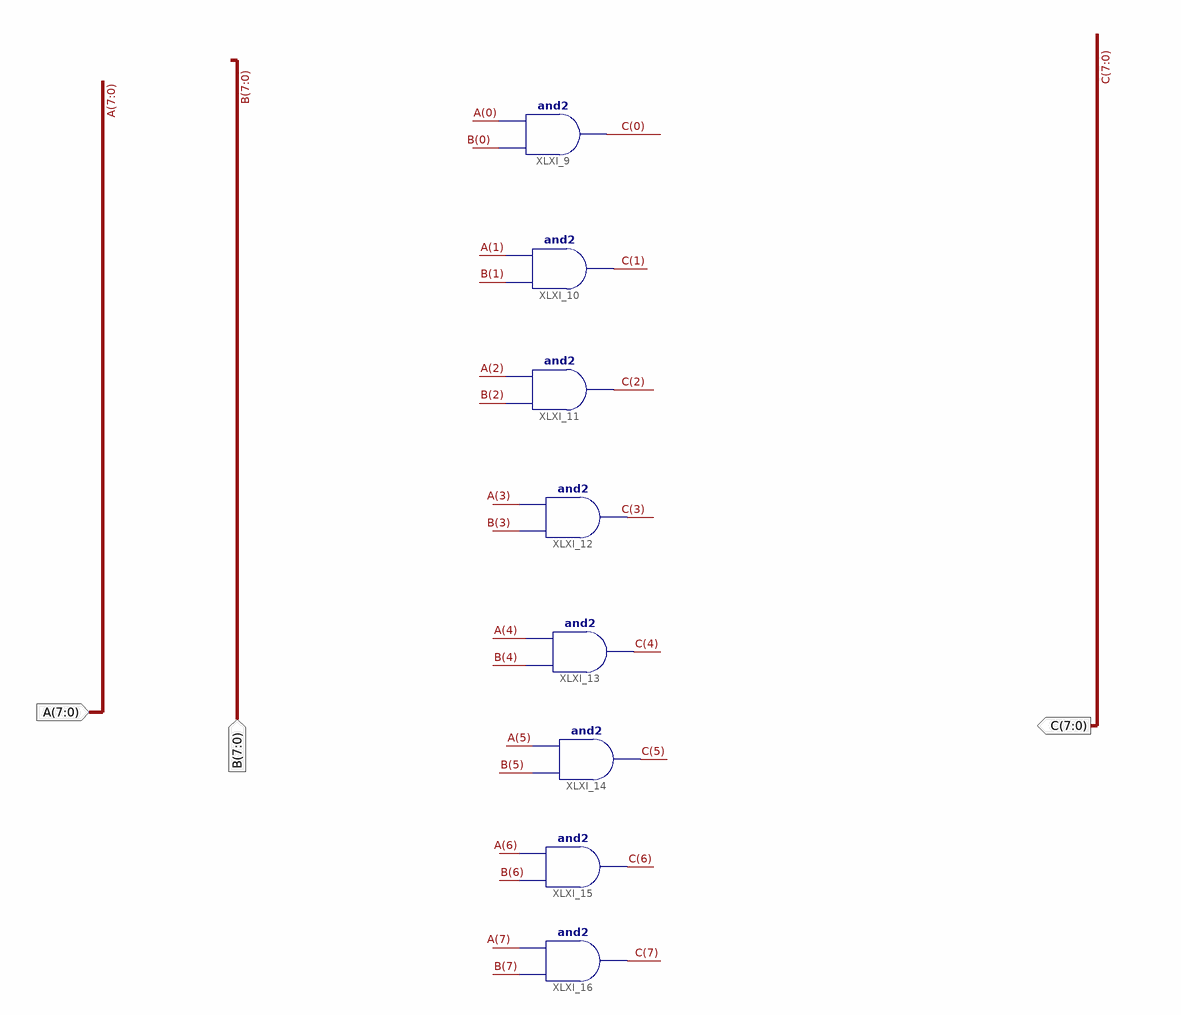
[diagram p0: schematic sheet 1]
// Xilinx ISE schematic and2_8bits.sch (artix7) as structural Verilog: 8 symbols, 3 ports
module and2_8bits (
  input  [7:0] A,
  input  [7:0] B,
  output [7:0] C
);

  and XLXI_9 (C[0], B[0], A[0]);
  and XLXI_10 (C[1], B[1], A[1]);
  and XLXI_11 (C[2], B[2], A[2]);
  and XLXI_12 (C[3], B[3], A[3]);
  and XLXI_13 (C[4], B[4], A[4]);
  and XLXI_14 (C[5], B[5], A[5]);
  and XLXI_15 (C[6], B[6], A[6]);
  and XLXI_16 (C[7], B[7], A[7]);
endmodule
